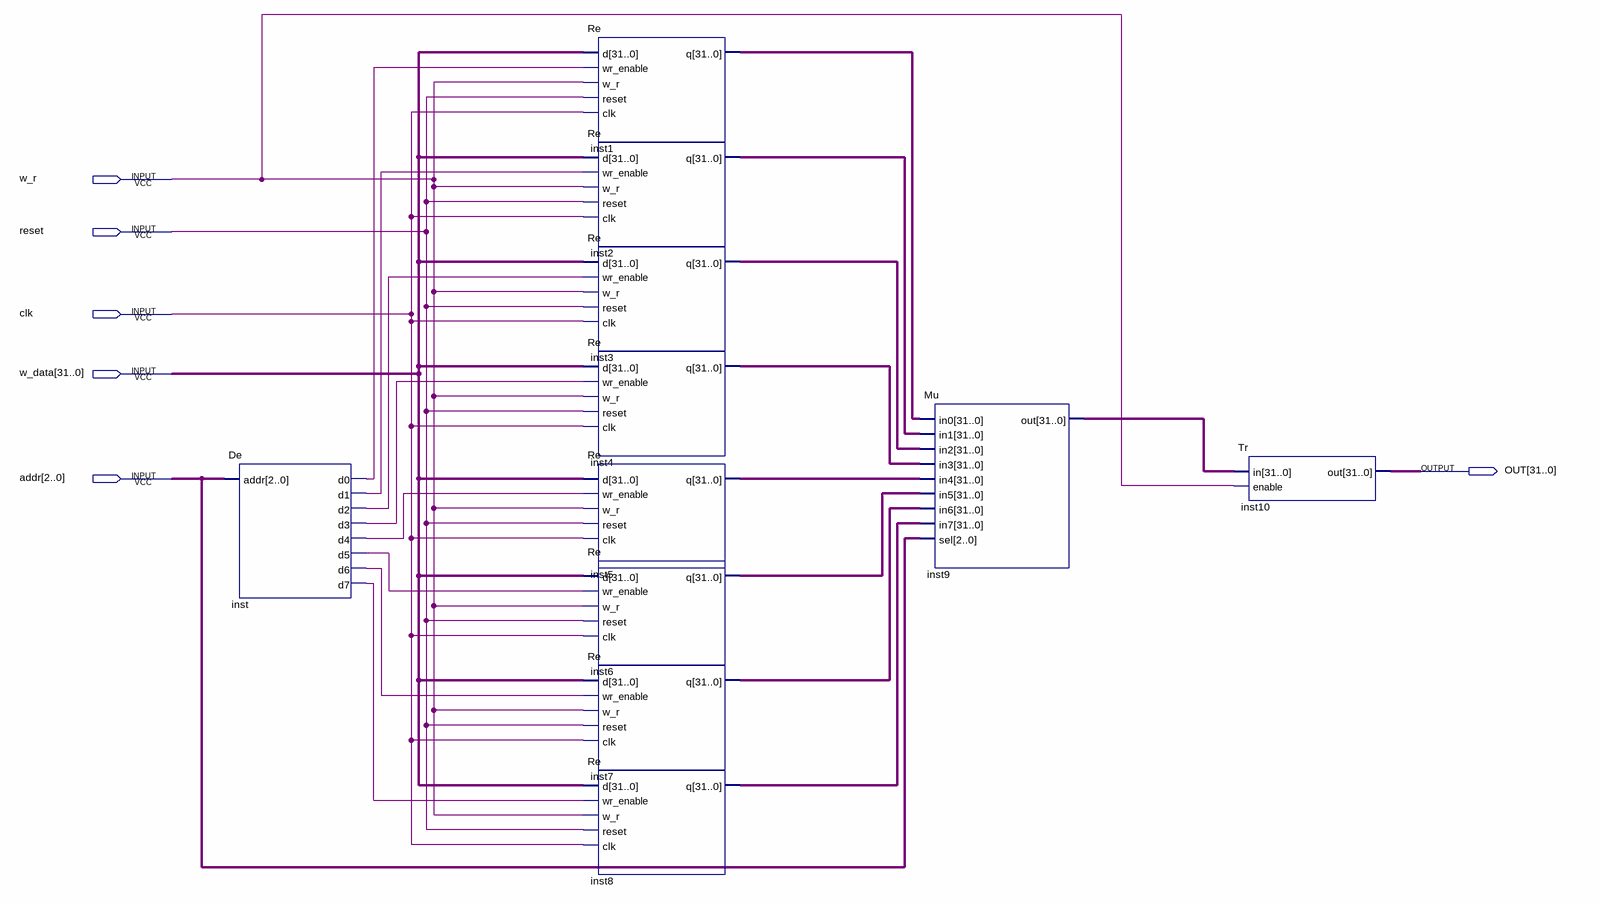
[diagram p0: schematic sheet]
// Quartus schematic REG.bdf as structural Verilog: 11 symbols, 6 pins
module REG (
  input  w_r,
  input  reset,
  input  clk,
  input  [31:0] w_data,
  input  [2:0] addr,
  output [31:0] OUT
);

  wire inst_d0, inst_d1, inst_d2, inst_d3, inst_d4, inst_d5, inst_d6, inst_d7;
  wire [31:0] inst1_q, inst2_q, inst3_q, inst4_q, inst5_q, inst6_q, inst7_q, inst8_q, inst9_out;

  De inst (
    .addr(addr), .d0(inst_d0), .d1(inst_d1), .d2(inst_d2), .d3(inst_d3), .d4(inst_d4), .d5(inst_d5),
    .d6(inst_d6), .d7(inst_d7));
  Re inst1 (.d(w_data), .wr_enable(inst_d0), .w_r(w_r), .reset(reset), .clk(clk), .q(inst1_q));
  Re inst2 (.d(w_data), .wr_enable(inst_d1), .w_r(w_r), .reset(reset), .clk(clk), .q(inst2_q));
  Re inst3 (.d(w_data), .wr_enable(inst_d2), .w_r(w_r), .reset(reset), .clk(clk), .q(inst3_q));
  Re inst4 (.d(w_data), .wr_enable(inst_d3), .w_r(w_r), .reset(reset), .clk(clk), .q(inst4_q));
  Re inst5 (.d(w_data), .wr_enable(inst_d4), .w_r(w_r), .reset(reset), .clk(clk), .q(inst5_q));
  Re inst6 (.d(w_data), .wr_enable(inst_d5), .w_r(w_r), .reset(reset), .clk(clk), .q(inst6_q));
  Re inst7 (.d(w_data), .wr_enable(inst_d6), .w_r(w_r), .reset(reset), .clk(clk), .q(inst7_q));
  Re inst8 (.d(w_data), .wr_enable(inst_d7), .w_r(w_r), .reset(reset), .clk(clk), .q(inst8_q));
  Mu inst9 (
    .in0(inst1_q), .in1(inst2_q), .in2(inst3_q), .in3(inst4_q), .in4(inst5_q), .in5(inst6_q), .in6(inst7_q),
    .in7(inst8_q), .sel(addr), .out(inst9_out));
  Tr inst10 (.in(inst9_out), .enable(w_r), .out(OUT));
endmodule
